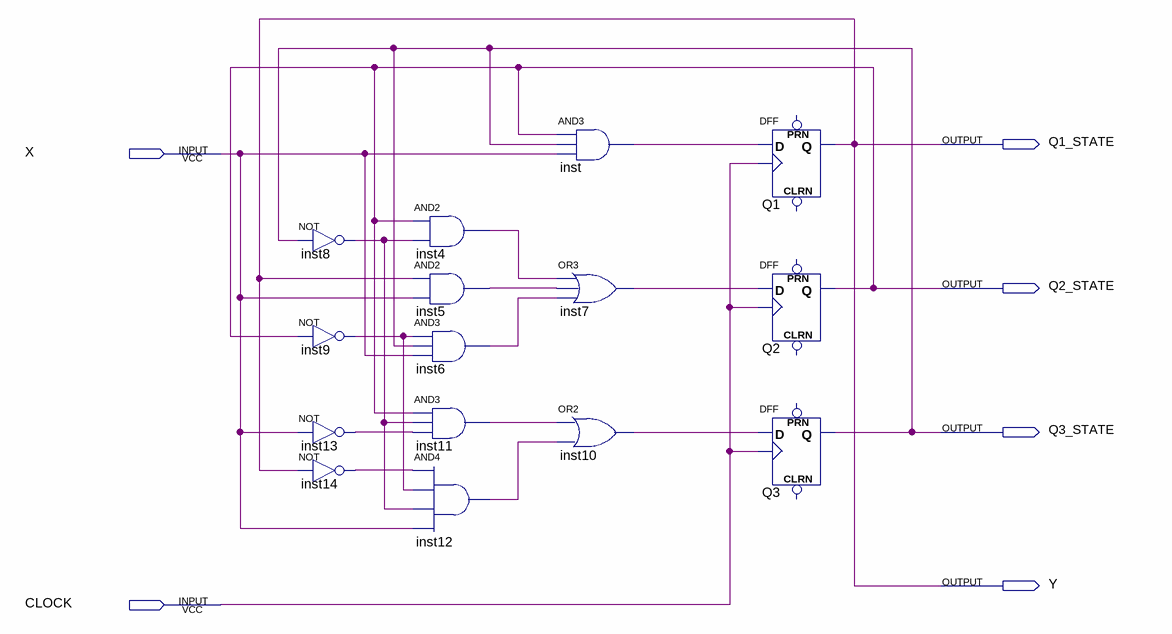
[diagram p0: schematic sheet]
// Quartus schematic Sequence_Recognizer.bdf as structural Verilog: 15 symbols, 6 pins
module Sequence_Recognizer (
  input  X,
  input  CLOCK,
  output Q1_STATE,
  output Q2_STATE,
  output Q3_STATE,
  output Y
);

  wire inst4_out, inst5_out, inst6_out, inst7_out, inst8_out, inst9_out, inst10_out, inst11_out, inst12_out,
       inst13_out, inst14_out, inst_out;

  not inst8 (inst8_out, Q3_STATE);
  not inst9 (inst9_out, Q2_STATE);
  not inst13 (inst13_out, X);
  not inst14 (inst14_out, Q1_STATE);
  and inst4 (inst4_out, Q2_STATE, inst8_out);
  and inst5 (inst5_out, Q1_STATE, X);
  and inst6 (inst6_out, inst9_out, Q3_STATE, X);
  and inst11 (inst11_out, Q2_STATE, inst8_out, inst13_out);
  and inst12 (inst12_out, inst14_out, inst9_out, inst8_out, X);
  and inst (inst_out, Q2_STATE, Q3_STATE, X);
  or inst7 (inst7_out, inst4_out, inst5_out, inst6_out);
  or inst10 (inst10_out, inst11_out, inst12_out);
  DFF Q1 (.CLK(CLOCK), .D(inst_out), .Q(Q1_STATE));  // open: CLRN, PRN
  DFF Q2 (.CLK(CLOCK), .D(inst7_out), .Q(Q2_STATE));  // open: CLRN, PRN
  DFF Q3 (.CLK(CLOCK), .D(inst10_out), .Q(Q3_STATE));  // open: CLRN, PRN

  assign Y = Q1_STATE;
endmodule
